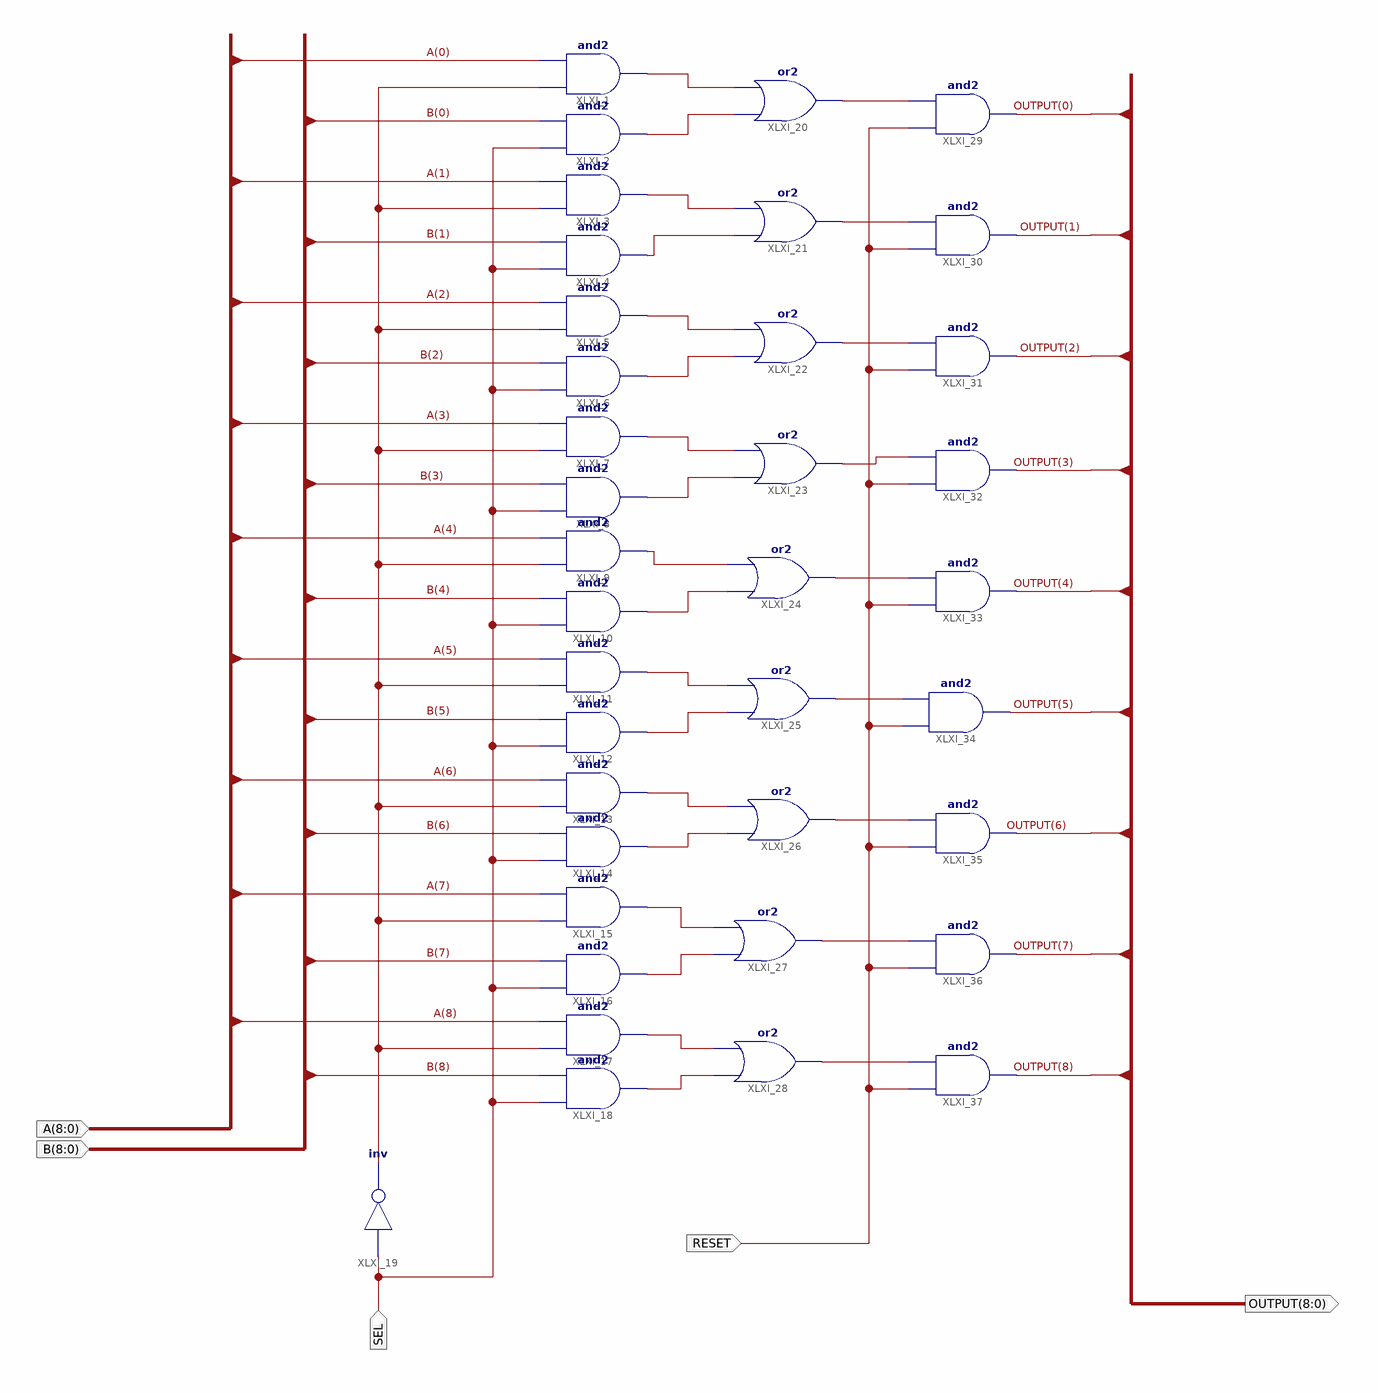
[diagram p0: schematic sheet 1]
// Xilinx ISE schematic Two_to_One_MUX_Nine_Bit.sch (spartan6) as structural Verilog: 37 symbols, 5 ports
module Two_to_One_MUX_Nine_Bit (
  input  [8:0] A,
  input  [8:0] B,
  input  SEL,
  input  RESET,
  output [8:0] OUTPUT
);

  wire XLXN_22, XLXN_26, XLXN_27, XLXN_28, XLXN_30, XLXN_31, XLXN_32, XLXN_33, XLXN_34, XLXN_36, XLXN_37,
       XLXN_38, XLXN_39, XLXN_40, XLXN_41, XLXN_42, XLXN_43, XLXN_44, XLXN_45, XLXN_46, XLXN_47, XLXN_48,
       XLXN_49, XLXN_50, XLXN_51, XLXN_52, XLXN_54, XLXN_55;

  and XLXI_1 (XLXN_26, XLXN_22, A[0]);
  and XLXI_2 (XLXN_27, SEL, B[0]);
  and XLXI_3 (XLXN_28, XLXN_22, A[1]);
  and XLXI_4 (XLXN_30, SEL, B[1]);
  and XLXI_5 (XLXN_31, XLXN_22, A[2]);
  and XLXI_6 (XLXN_32, SEL, B[2]);
  and XLXI_7 (XLXN_33, XLXN_22, A[3]);
  and XLXI_8 (XLXN_34, SEL, B[3]);
  and XLXI_9 (XLXN_36, XLXN_22, A[4]);
  and XLXI_10 (XLXN_37, SEL, B[4]);
  and XLXI_11 (XLXN_38, XLXN_22, A[5]);
  and XLXI_12 (XLXN_39, SEL, B[5]);
  and XLXI_13 (XLXN_42, XLXN_22, A[6]);
  and XLXI_14 (XLXN_43, SEL, B[6]);
  and XLXI_15 (XLXN_40, XLXN_22, A[7]);
  and XLXI_16 (XLXN_41, SEL, B[7]);
  and XLXI_17 (XLXN_44, XLXN_22, A[8]);
  and XLXI_18 (XLXN_45, SEL, B[8]);
  not XLXI_19 (XLXN_22, SEL);
  or XLXI_20 (XLXN_46, XLXN_27, XLXN_26);
  or XLXI_21 (XLXN_47, XLXN_30, XLXN_28);
  or XLXI_22 (XLXN_48, XLXN_32, XLXN_31);
  or XLXI_23 (XLXN_49, XLXN_34, XLXN_33);
  or XLXI_24 (XLXN_50, XLXN_37, XLXN_36);
  or XLXI_25 (XLXN_51, XLXN_39, XLXN_38);
  or XLXI_26 (XLXN_52, XLXN_43, XLXN_42);
  or XLXI_27 (XLXN_54, XLXN_41, XLXN_40);
  or XLXI_28 (XLXN_55, XLXN_45, XLXN_44);
  and XLXI_29 (OUTPUT[0], RESET, XLXN_46);
  and XLXI_30 (OUTPUT[1], RESET, XLXN_47);
  and XLXI_31 (OUTPUT[2], RESET, XLXN_48);
  and XLXI_32 (OUTPUT[3], RESET, XLXN_49);
  and XLXI_33 (OUTPUT[4], RESET, XLXN_50);
  and XLXI_34 (OUTPUT[5], RESET, XLXN_51);
  and XLXI_35 (OUTPUT[6], RESET, XLXN_52);
  and XLXI_36 (OUTPUT[7], RESET, XLXN_54);
  and XLXI_37 (OUTPUT[8], RESET, XLXN_55);
endmodule
